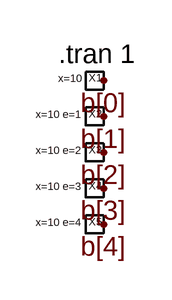
[diagram p0: schematic test-bit-extract.asc]
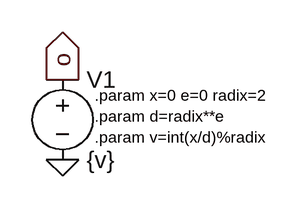
[diagram p1: sub-circuit bit-extract.asc]
test-bit-extract.asc, the LTspice schematic file:
Version 4
SHEET 1 880 680
FLAG 112 112 b[0]
FLAG 112 144 b[1]
FLAG 112 176 b[2]
FLAG 112 208 b[3]
FLAG 112 240 b[4]
SYMBOL bit-extract 96 112 R0
WINDOW 0 9 4 Bottom 0
WINDOW 39 -2 -2 Right 0
SYMATTR InstName X1
SYMATTR SpiceLine x=10
SYMBOL bit-extract 96 144 R0
WINDOW 0 9 4 Bottom 0
WINDOW 39 -2 -2 Right 0
SYMATTR InstName X2
SYMATTR SpiceLine x=10 e=1
SYMBOL bit-extract 96 176 R0
WINDOW 0 9 4 Bottom 0
WINDOW 39 -2 -2 Right 0
SYMATTR InstName X3
SYMATTR SpiceLine x=10 e=2
SYMBOL bit-extract 96 208 R0
WINDOW 0 9 4 Bottom 0
WINDOW 39 -2 -2 Right 0
SYMATTR InstName X4
SYMATTR SpiceLine x=10 e=3
SYMBOL bit-extract 96 240 R0
WINDOW 0 9 4 Bottom 0
WINDOW 39 -2 -2 Right 0
SYMATTR InstName X5
SYMATTR SpiceLine x=10 e=4
TEXT 72 88 Left 2 !.tran 1

bit-extract.asc, the sub-circuit schematic file:
Version 4
SHEET 1 880 680
FLAG 112 208 0
FLAG 112 128 o
IOPIN 112 128 Out
SYMBOL voltage 112 112 R0
SYMATTR InstName V1
SYMATTR Value {v}
TEXT 144 144 Left 1 !.param x=0 e=0 radix=2\n.param d=radix**e\n.param v=int(x/d)%radix

The netlist it stands for:
* test-bit-extract.asc
XX1 b[0] bit-extract params: x=10
XX2 b[1] bit-extract params: x=10 e=1
XX3 b[2] bit-extract params: x=10 e=2
XX4 b[3] bit-extract params: x=10 e=3
XX5 b[4] bit-extract params: x=10 e=4

* block symbol definitions
.subckt bit-extract o
V1 o 0 {v}
.param x=0 e=0 radix=2
.param d=radix**e
.param v=int(x/d)%radix
.ends bit-extract

.tran 1
.backanno
.end